# EAGLE schematic Motor_h_bruecke (EAGLE 6.5.0)
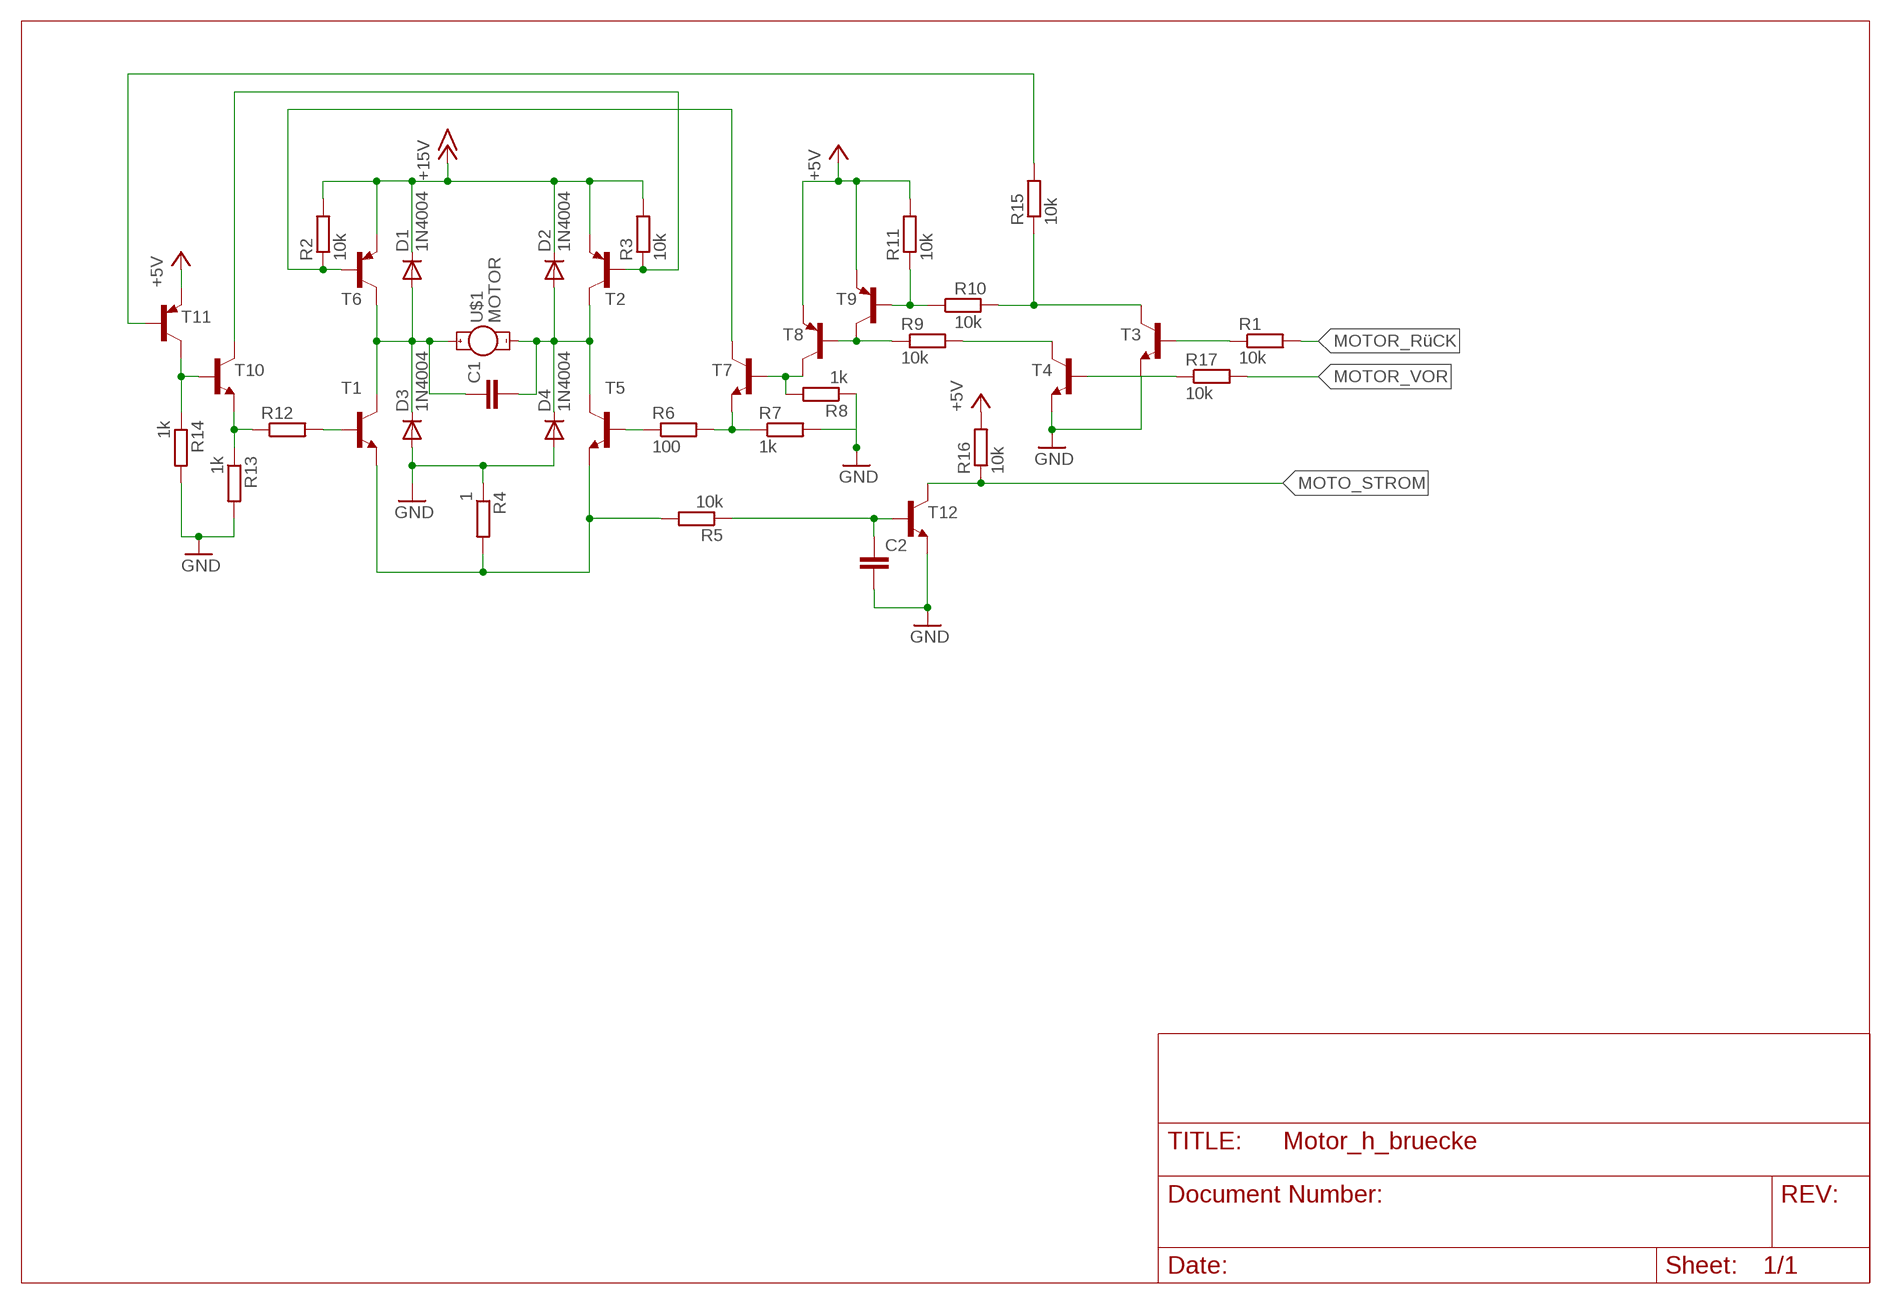
[diagram p0: schematic, sheet 1]

## Parts
C1  C-EUC0805  [C0805]
C2  C-EUC0805  [C0805]
D1  1N4004  [DO41-10]
D2  1N4004  [DO41-10]
D3  1N4004  [DO41-10]
D4  1N4004  [DO41-10]
R1  10k  R-EU_R0805  [R0805]
R2  10k  R-EU_R0805  [R0805]
R3  10k  R-EU_R0805  [R0805]
R4  1  R-EU_R0805  [R0805]
R5  10k  R-EU_R0805  [R0805]
R6  100  R-EU_R0805  [R0805]
R7  1k  R-EU_R0805  [R0805]
R8  1k  R-EU_R0805  [R0805]
R9  10k  R-EU_R0805  [R0805]
R10  10k  R-EU_R0805  [R0805]
R11  10k  R-EU_R0805  [R0805]
R12  R-EU_R0805  [R0805]
R13  1k  R-EU_R0805  [R0805]
R14  1k  R-EU_R0805  [R0805]
R15  10k  R-EU_R0805  [R0805]
R16  10k  R-EU_R0805  [R0805]
R17  10k  R-EU_R0805  [R0805]
T1  -NPN-TO225AA  [TO225AA]
T2  -PNP-TO225AA  [TO225AA]
T3  BC337-40-NPN-TO92-CBE  [TO92-CBE]
T4  BC337-40-NPN-TO92-CBE  [TO92-CBE]
T5  -NPN-TO225AA  [TO225AA]
T6  -PNP-TO225AA  [TO225AA]
T7  BC808-NPN-SOT23-BEC  [SOT23-BEC]
T8  BC807-16-PNP-SOT23-BEC  [SOT23-BEC]
T9  BC807-16-PNP-SOT23-BEC  [SOT23-BEC]
T10  BC808-NPN-SOT23-BEC  [SOT23-BEC]
T11  BC807-16-PNP-SOT23-BEC  [SOT23-BEC]
T12  BC808-NPN-SOT23-BEC  [SOT23-BEC]
U$1  MOTOR  MOTOR10MM  [VIBE-MOTOR-10MM]

## Nets
+5V: R11.2 R16.2 T8.E T9.E T11.E
+15V: D1.C D2.C R2.2 R3.2 T2.3(E) T6.3(E)
GND: C2.2 D3.A D4.A R4.1 R7.2 R8.1 R13.2 R14.2 T3.E T4.E T12.E
MOTO_STROM: R16.1 T12.C
MOTOR_RüCK: R1.2
MOTOR_VOR: R17.2
N$1: R9.1 T8.B T9.C
N$2: C1.1 D1.A D3.C T1.2(C) T6.2(C) U$1.+
N$3: R10.1 R11.1 T9.B
N$4: C1.2 D2.A D4.C T2.2(C) T5.2(C) U$1.-
N$5: R8.2 T7.B T8.C
N$6: R15.2 T11.B
N$7: R2.1 T6.1(B) T7.C
N$8: R3.1 T2.1(B) T10.C
N$9: R4.2 R5.2 T1.3(E) T5.3(E)
N$10: R6.1 T5.1(B)
N$11: R6.2 R7.1 T7.E
N$12: R1.1 T3.B
N$13: R17.1 T4.B
N$14: R12.1 R13.1 T10.E
N$15: R14.1 T10.B T11.C
N$17: R12.2 T1.1(B)
N$19: R10.2 R15.1 T3.C
N$20: C2.1 R5.1 T12.B
N$23: R9.2 T4.C

## Library data of the parts
C1 C2 = resistor:C-EU: CAPACITOR, European symbol
D1-D4 = diode:1N4004: DIODE general purpose rectifier, 1 A
R1-R17 = resistor:R-EU_: RESISTOR, European symbol
T1 T3-T5 T7 T10 T12 = transistor:*-NPN-: NPN Transistror BF959 corrected 2008.03.06
T2 T6 T8 T9 T11 = transistor:*-PNP-: PNP Transistror
U$1 = SparkFun-Electromechanical:MOTOR: Vibration Motor- ROB-08449 Physical dimension and wire connections for this powerful vibration motor. Motor has a self adhesive backing.